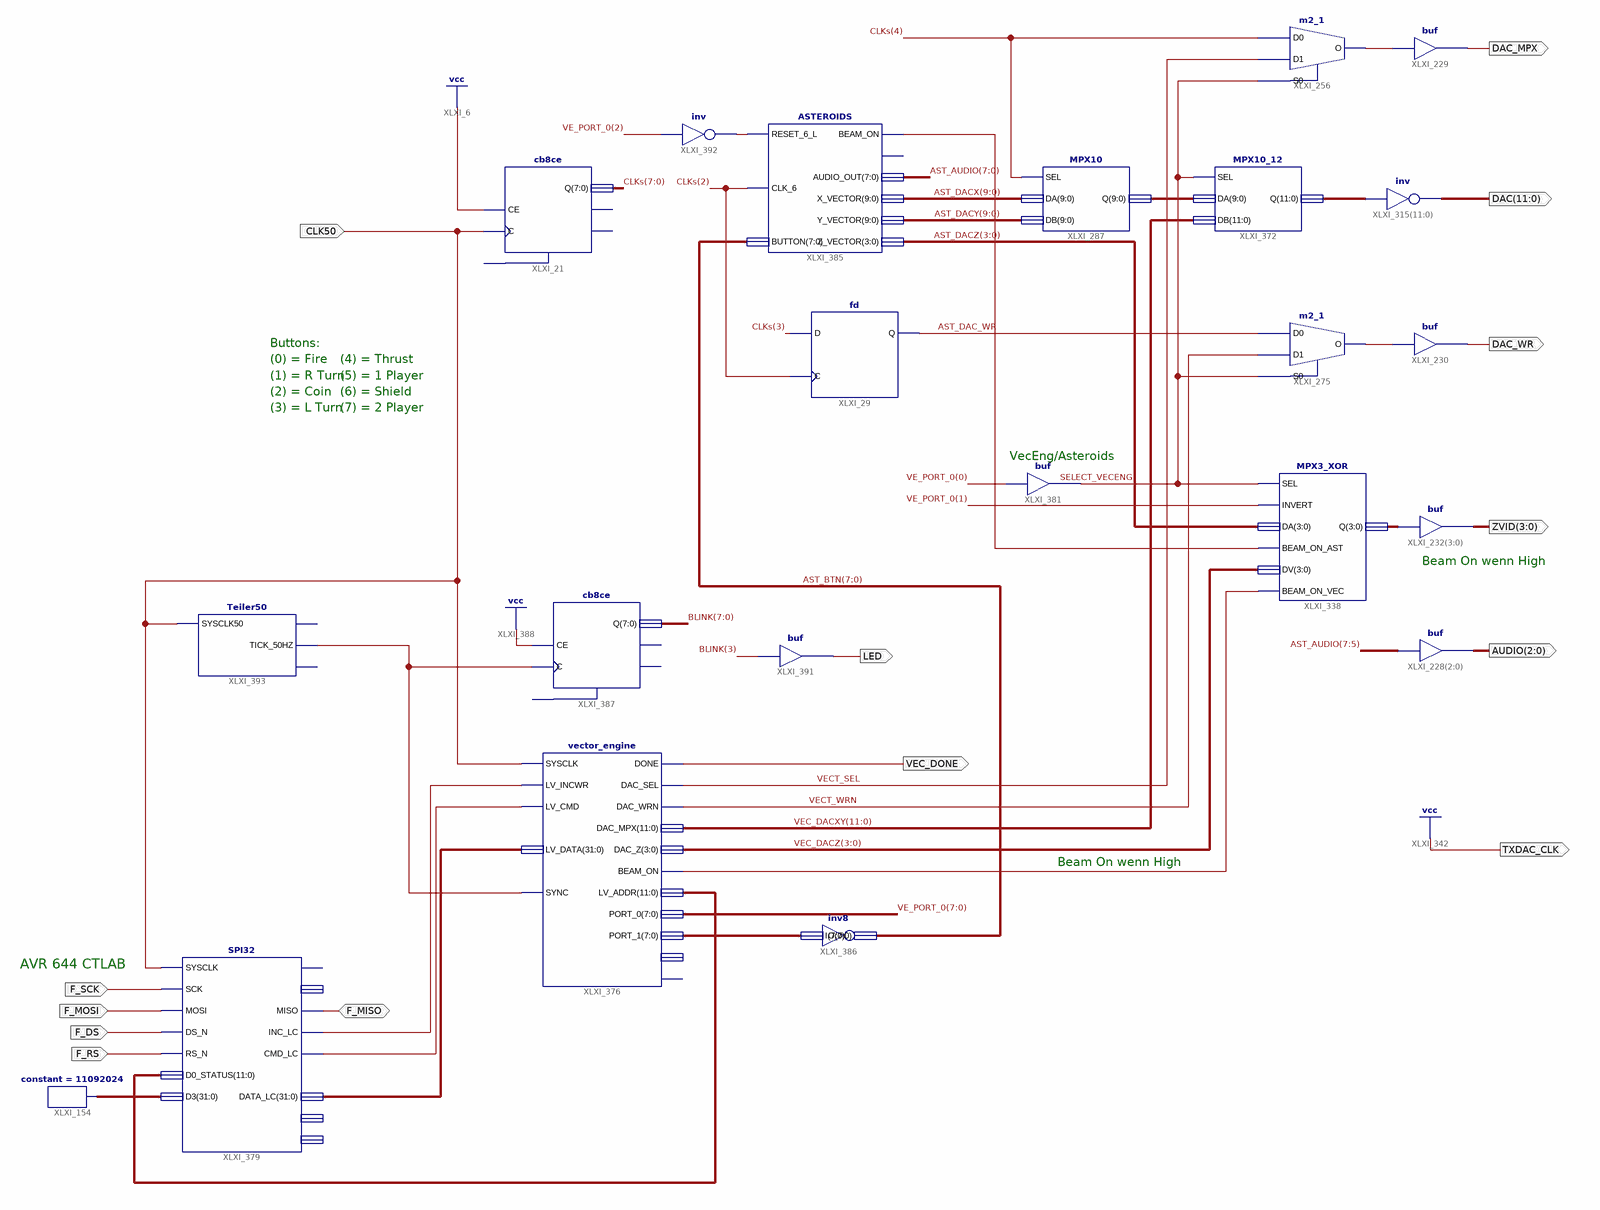
[diagram p0: schematic sheet 1]
// Xilinx ISE schematic AsteroidsClockAVR.sch (spartan3) as structural Verilog: 22 symbols, 14 ports
module AsteroidsClockAVR (
  input  CLK50,
  input  F_SCK,
  input  F_MOSI,
  input  F_DS,
  input  F_RS,
  inout  F_MISO,
  output DAC_MPX,
  output DAC_WR,
  output [11:0] DAC,
  output [3:0] ZVID,
  output TXDAC_CLK,
  output VEC_DONE,
  output LED,
  output [2:0] AUDIO
);

  wire AST_DAC_WR, SELECT_VECENG, VECT_SEL, VECT_WRN, XLXN_583, XLXN_640, XLXN_703, XLXN_713, XLXN_714,
       XLXN_719, XLXN_720, XLXN_722;
  wire [3:0] AST_DACZ, VEC_DACZ, XLXN_562;
  wire [7:0] AST_AUDIO, AST_BTN, BLINK, CLKs, VE_PORT_0, XLXN_708;
  wire [9:0] AST_DACX, AST_DACY, XLXN_383;
  wire [11:0] VEC_DACXY, XLXN_519, XLXN_695;
  wire [31:0] XLXN_687, XLXN_715;

  cb8ce XLXI_21 (.C(CLK50), .CE(1'b1), .Q(CLKs));  // open: CLR, CEO, TC
  fd XLXI_29 (.C(CLKs[2]), .D(CLKs[3]), .Q(AST_DAC_WR));
  m2_1 XLXI_256 (.D0(CLKs[4]), .D1(VECT_SEL), .S0(SELECT_VECENG), .O(XLXN_640));
  buf XLXI_229 (DAC_MPX, XLXN_640);
  buf XLXI_230 (DAC_WR, XLXN_583);
  MPX10 XLXI_287 (.DA(AST_DACX), .DB(AST_DACY), .Q(XLXN_383), .SEL(CLKs[4]));
  assign DAC = ~XLXN_519;  // inv XLXI_315[11..0], 12 bits wide
  assign ZVID = XLXN_562;  // buf XLXI_232[3..0], 4 bits wide
  MPX3_XOR XLXI_338 (
    .BEAM_ON_AST(XLXN_720), .BEAM_ON_VEC(XLXN_722), .SEL(SELECT_VECENG), .INVERT(VE_PORT_0[1]),
    .DA(AST_DACZ), .DV(VEC_DACZ), .Q(XLXN_562));
  m2_1 XLXI_275 (.D0(AST_DAC_WR), .D1(VECT_WRN), .S0(SELECT_VECENG), .O(XLXN_583));
  MPX10_12 XLXI_372 (.SEL(SELECT_VECENG), .DA(XLXN_383), .DB(VEC_DACXY), .Q(XLXN_519));
  constant #(.CValue("11092024")) XLXI_154 (.O(XLXN_687));
  vector_engine XLXI_376 (
    .SYSCLK(CLK50), .LV_INCWR(XLXN_713), .LV_CMD(XLXN_714), .SYNC(XLXN_703), .LV_DATA(XLXN_715),
    .DONE(VEC_DONE), .BEAM_ON(XLXN_722), .DAC_SEL(VECT_SEL), .DAC_WRN(VECT_WRN), .DAC_MPX(VEC_DACXY),
    .DAC_Z(VEC_DACZ), .LV_ADDR(XLXN_695), .PORT_0(VE_PORT_0), .PORT_1(XLXN_708));  // open: TEST, VEC_ADDR
  SPI32 XLXI_379 (
    .SYSCLK(CLK50), .SCK(F_SCK), .MOSI(F_MOSI), .DS_N(F_DS), .RS_N(F_RS), .D0_STATUS(XLXN_695),
    .D3(XLXN_687), .MISO(F_MISO), .CMD_LC(XLXN_714), .INC_LC(XLXN_713), .DATA_LC(XLXN_715));  // open: STROBE, RSEL, Q1_CONF, Q2_CONF
  buf XLXI_381 (SELECT_VECENG, VE_PORT_0[0]);
  ASTEROIDS XLXI_385 (
    .RESET_6_L(XLXN_719), .CLK_6(CLKs[2]), .BUTTON(AST_BTN), .BEAM_ON(XLXN_720), .AUDIO_OUT(AST_AUDIO),
    .X_VECTOR(AST_DACX), .Y_VECTOR(AST_DACY), .Z_VECTOR(AST_DACZ));  // open: BEAM_ENA
  inv8 XLXI_386 (.I(XLXN_708), .O(AST_BTN));
  cb8ce XLXI_387 (.C(XLXN_703), .CE(1'b1), .Q(BLINK));  // open: CLR, CEO, TC
  buf XLXI_391 (LED, BLINK[3]);
  not XLXI_392 (XLXN_719, VE_PORT_0[2]);
  Teiler50 XLXI_393 (.SYSCLK50(CLK50), .TICK_50HZ(XLXN_703));  // open: TICK_100HZ, SQW_50HZ
  assign AUDIO = AST_AUDIO[7:5];  // buf XLXI_228[2..0], 3 bits wide

  assign TXDAC_CLK = 1'b1;

  // Notes on the sheet:
  //   Buttons:
  //   (0) = Fire
  //   (4) = Thrust
  //   (1) = R Turn
  //   (5) = 1 Player
  //   (2) = Coin
  //   (6) = Shield
  //   (3) = L Turn
  //   (7) = 2 Player
  //   VecEng/Asteroids
  //   Beam On wenn High
  //   Beam On wenn High
  //   AVR 644 CTLAB
endmodule
